# EAGLE schematic MIDICV (EAGLE 7.7.0)
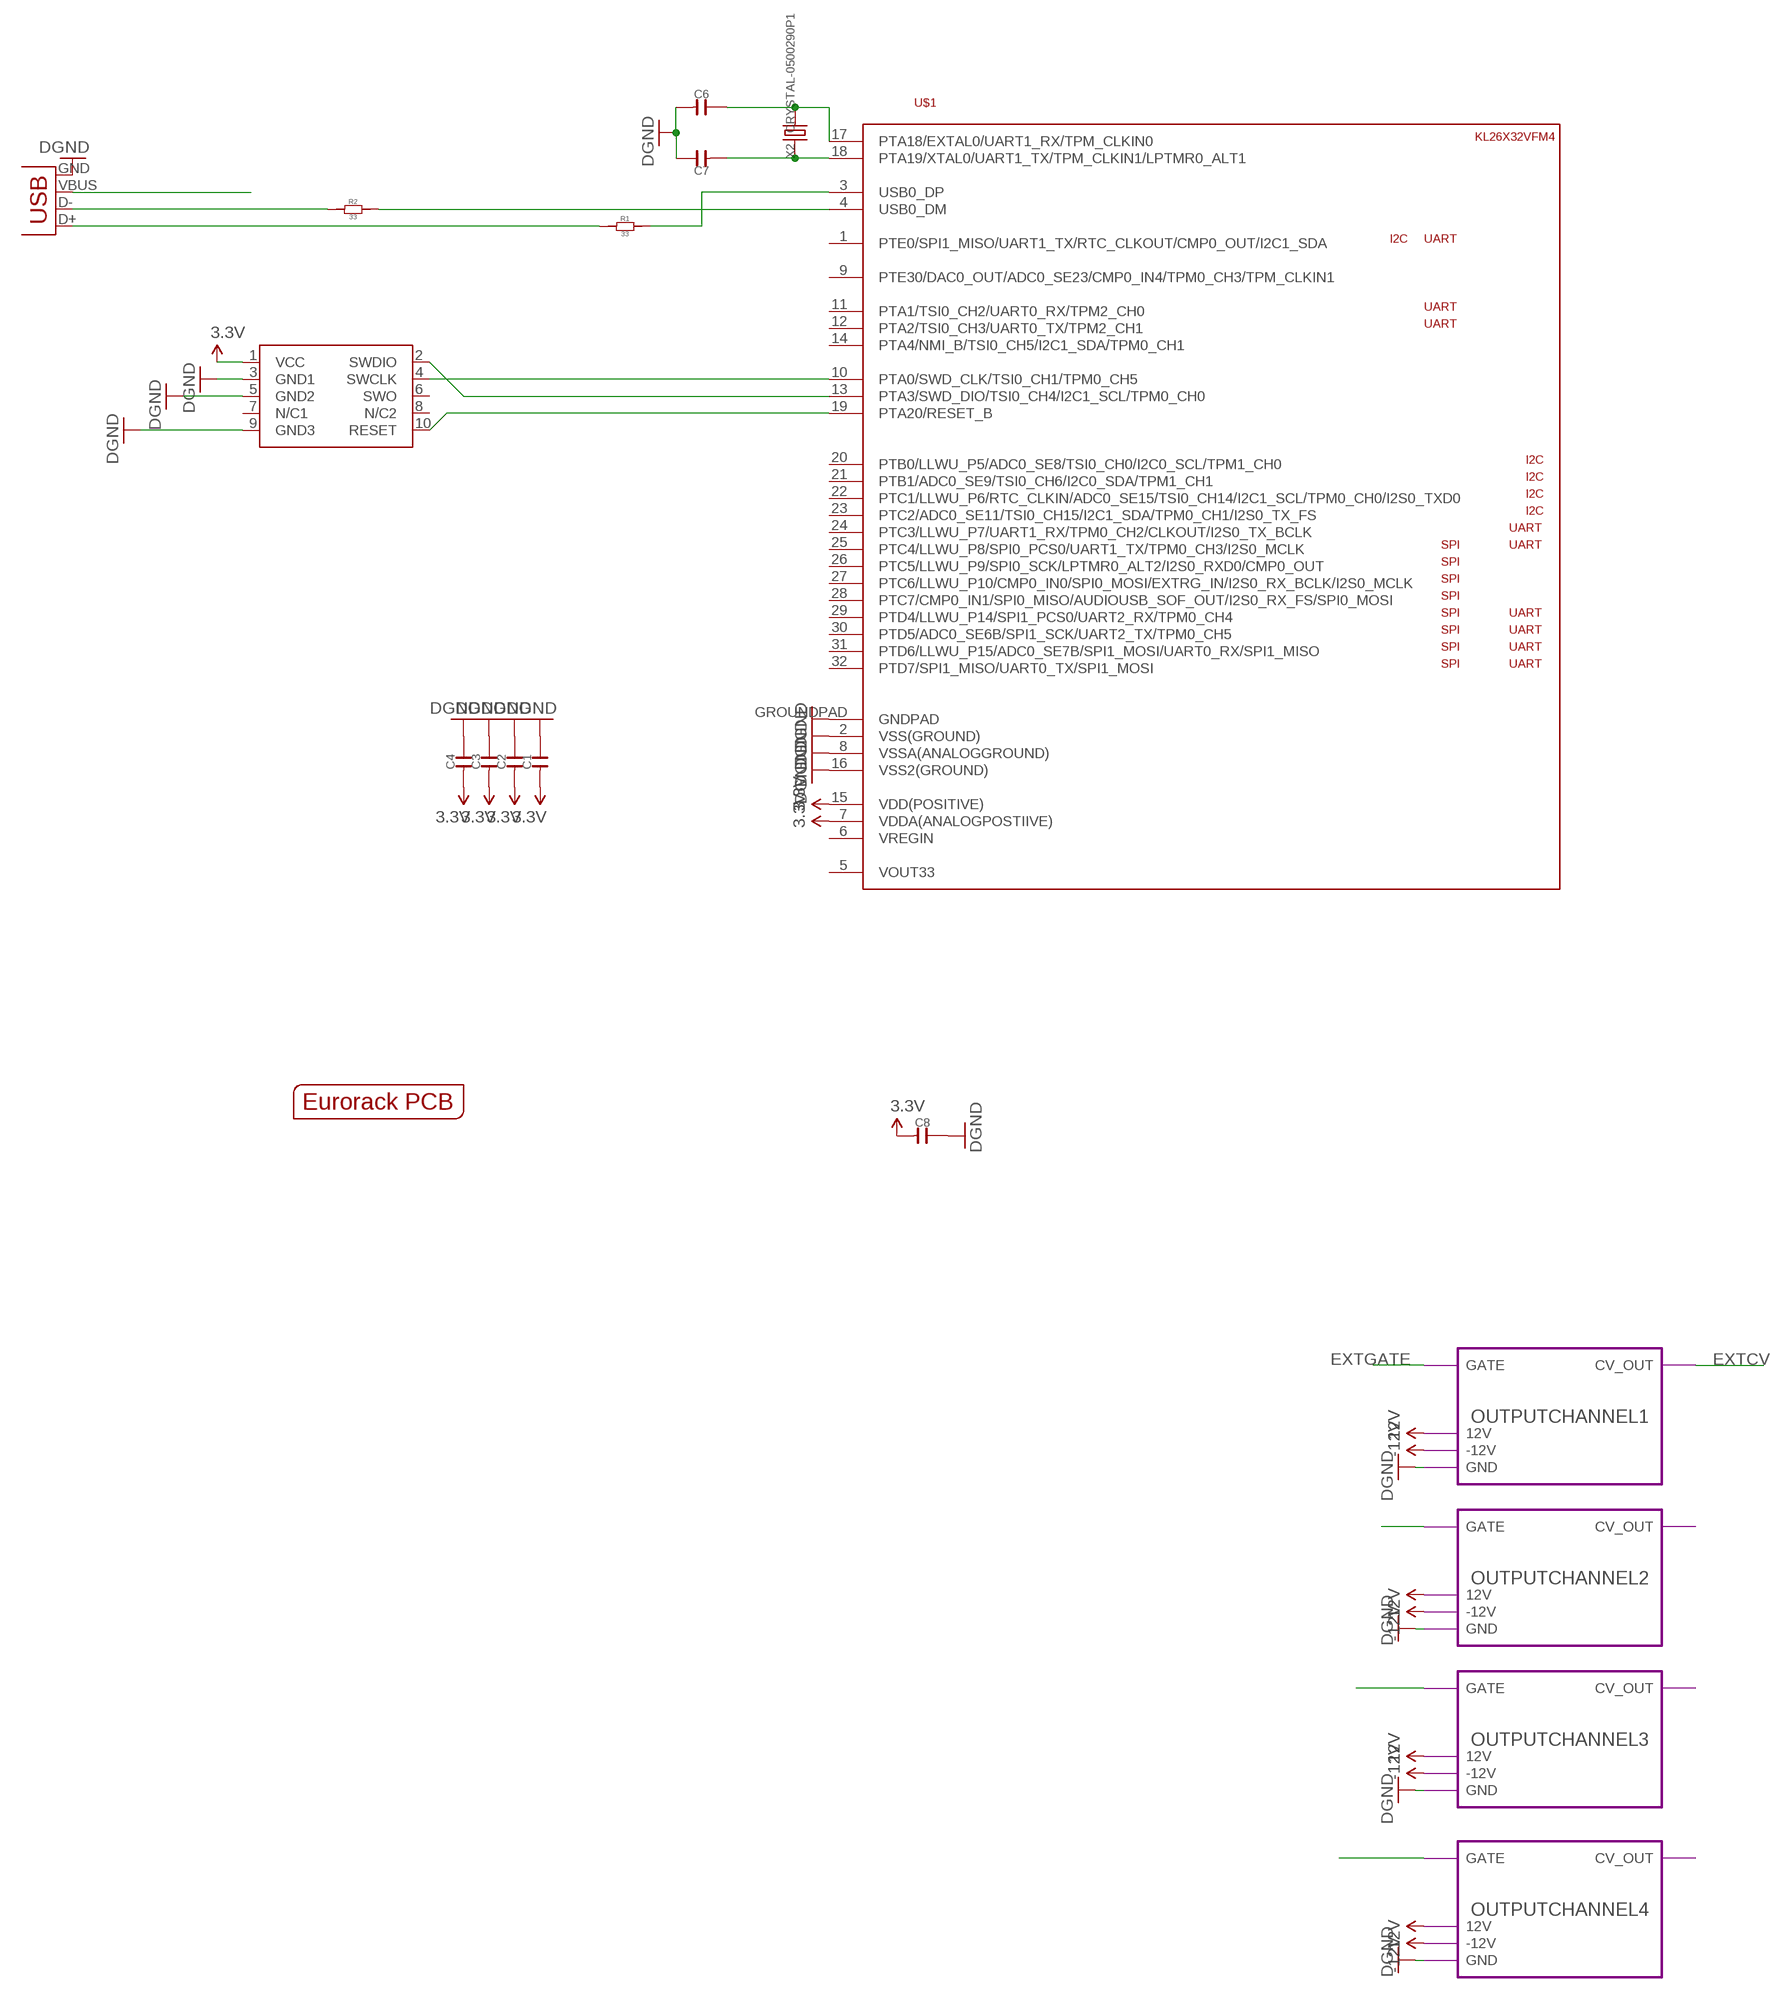
[diagram p0: schematic, sheet 1, part 1 of 2]
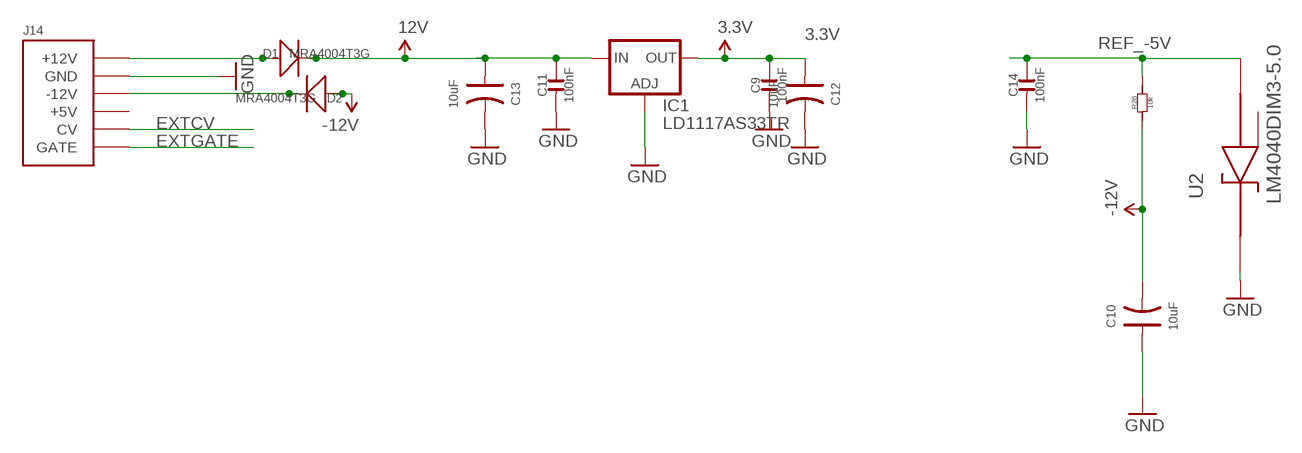
[diagram p1: schematic, sheet 1, part 2 of 2]

## Parts
C1  C-0603  [C0603]
C2  C-0603  [C0603]
C3  C-0603  [C0603]
C4  C-0603  [C0603]
C6  C-0603  [C0603]
C7  C-0603  [C0603]
C8  C-0603  [C0603]
C9  100nF  C-0603  [C0603]
C10  10uF  C-POLAR-A  [AVX-A]
C11  100nF  C-0603  [C0603]
C12  10uF  C-POLAR-A  [AVX-A]
C13  10uF  C-POLAR-A  [AVX-A]
C14  100nF  C-0603  [C0603]
D1  MRA4004T3G  D-SMA  [DO-214AC]
D2  MRA4004T3G  D-SMA  [DO-214AC]
IC1  LD1117AS33TR  [SOT223]
J14  POWERSMT  [2X08_SMT_HEADER]
JP1  USBPTH-VERTICAL  [USB-B-PTH-VERTICAL]
R1  33  R-0603  [R0603]
R2  33  R-0603  [R0603]
R26  10k  R-0603  [R0603]
SWD1  CORTEX_SWD  [M50-3600542]
U2  LM4040DIM3-5.0  [SOT95P237X112-3N]
U$1  KL26X32VFM4  [QFN-32]
U$2  EURORACK_PCB12HP  [EURORACK12HPPCB]
X2  CRYSTAL-0500290P1  [2P-SMD-5.0X3.2]

## Module instances
OUTPUTCHANNEL1 = OUTPUTCHANNEL
OUTPUTCHANNEL2 = OUTPUTCHANNEL
OUTPUTCHANNEL3 = OUTPUTCHANNEL
OUTPUTCHANNEL4 = OUTPUTCHANNEL

## Nets
3.3V: C1.1 C2.1 C3.1 C4.1 C8.1 C9.2 C12.+ IC1.2(OUT) IC1.4(OUT) SWD1.1(VCC) U$1.7(VDDA(ANALOGPOSTIIVE)) U$1.15(VDD(POSITIVE))
12V [heavypower]: C11.2 C13.+ D1.2(-) IC1.3(IN) ; port OUTPUTCHANNEL1.12V OUTPUTCHANNEL2.12V OUTPUTCHANNEL3.12V OUTPUTCHANNEL4.12V
-12V [heavypower]: C10.- D2.1(+) R26.1 ; port OUTPUTCHANNEL2.-12V OUTPUTCHANNEL1.-12V OUTPUTCHANNEL3.-12V OUTPUTCHANNEL4.-12V
BUTTON4: SWD1.10(RESET) U$1.19(PTA20/RESET_B)
EXTCV: J14.13(CV) J14.14(CV) ; port OUTPUTCHANNEL1.CV_OUT
EXTGATE: J14.15(GATE) J14.16(GATE) ; port OUTPUTCHANNEL1.GATE
GND: C1.2 C2.2 C3.2 C4.2 C6.1 C7.2 C8.2 C9.1 C10.+ C11.1 C12.- C13.- C14.1 IC1.1(ADJ) J14.3(GND) J14.4(GND) J14.5(GND) J14.6(GND) J14.7(GND) J14.8(GND) JP1.GND SWD1.3(GND1) SWD1.5(GND2) SWD1.9(GND3) U2.1(CATHODE) U$1.2(VSS(GROUND)) U$1.8(VSSA(ANALOGGROUND)) U$1.16(VSS2(GROUND)) U$1.GROUNDPAD(GNDPAD) ; port OUTPUTCHANNEL1.GND OUTPUTCHANNEL3.GND OUTPUTCHANNEL4.GND OUTPUTCHANNEL2.GND ; supply symbol labelled DGND
N$1: JP1.D- R2.1
N$2: JP1.D+ R1.1
N$3: R1.2 U$1.3(USB0_DP)
N$4: R2.2 U$1.4(USB0_DM)
N$5: port OUTPUTCHANNEL2.GATE
N$6: port OUTPUTCHANNEL3.GATE
N$7: port OUTPUTCHANNEL4.GATE
N$11: C6.2 U$1.17(PTA18/EXTAL0/UART1_RX/TPM_CLKIN0) X2.2
N$12: C7.1 U$1.18(PTA19/XTAL0/UART1_TX/TPM_CLKIN1/LPTMR0_ALT1) X2.1
N$13 [heavypower]: D1.1(+) J14.9(+12V) J14.10(+12V)
N$64 [heavypower]: D2.2(-) J14.1(-12V) J14.2(-12V)
REF_-5V: C14.2 R26.2 U2.2(ANODE)
SWDCLK: SWD1.4(SWCLK) U$1.10(PTA0/SWD_CLK/TSI0_CH1/TPM0_CH5)
SWDIO: SWD1.2(SWDIO) U$1.13(PTA3/SWD_DIO/TSI0_CH4/I2C1_SCL/TPM0_CH0)
VBUS: JP1.VBUS
Unconnected: J14.11(+5V) J14.12(+5V) SWD1.6(SWO) SWD1.7(N/C1) SWD1.8(N/C2) U2.3(NC) U$1.1(PTE0/SPI1_MISO/UART1_TX/RTC_CLKOUT/CMP0_OUT/I2C1_SDA) U$1.5(VOUT33) U$1.6(VREGIN) U$1.9(PTE30/DAC0_OUT/ADC0_SE23/CMP0_IN4/TPM0_CH3/TPM_CLKIN1) U$1.11(PTA1/TSI0_CH2/UART0_RX/TPM2_CH0) U$1.12(PTA2/TSI0_CH3/UART0_TX/TPM2_CH1) U$1.14(PTA4/NMI_B/TSI0_CH5/I2C1_SDA/TPM0_CH1) U$1.20(PTB0/LLWU_P5/ADC0_SE8/TSI0_CH0/I2C0_SCL/TPM1_CH0) U$1.21(PTB1/ADC0_SE9/TSI0_CH6/I2C0_SDA/TPM1_CH1) U$1.22(PTC1/LLWU_P6/RTC_CLKIN/ADC0_SE15/TSI0_CH14/I2C1_SCL/TPM0_CH0/I2S0_TXD0) U$1.23(PTC2/ADC0_SE11/TSI0_CH15/I2C1_SDA/TPM0_CH1/I2S0_TX_FS) U$1.24(PTC3/LLWU_P7/UART1_RX/TPM0_CH2/CLKOUT/I2S0_TX_BCLK) U$1.25(PTC4/LLWU_P8/SPI0_PCS0/UART1_TX/TPM0_CH3/I2S0_MCLK) U$1.26(PTC5/LLWU_P9/SPI0_SCK/LPTMR0_ALT2/I2S0_RXD0/CMP0_OUT) U$1.27(PTC6/LLWU_P10/CMP0_IN0/SPI0_MOSI/EXTRG_IN/I2S0_RX_BCLK/I2S0_MCLK) U$1.28(PTC7/CMP0_IN1/SPI0_MISO/AUDIOUSB_SOF_OUT/I2S0_RX_FS/SPI0_MOSI) U$1.29(PTD4/LLWU_P14/SPI1_PCS0/UART2_RX/TPM0_CH4) U$1.30(PTD5/ADC0_SE6B/SPI1_SCK/UART2_TX/TPM0_CH5) U$1.31(PTD6/LLWU_P15/ADC0_SE7B/SPI1_MOSI/UART0_RX/SPI1_MISO) U$1.32(PTD7/SPI1_MISO/UART0_TX/SPI1_MOSI)

## Library data of the parts
C1-C4 C6-C8 = OPL:C*
C9 C11 = OPL:C*; MF: MULTICOMP; MPN: MC0603F104Z160CT; OC_FARNELL: 1759017
C10 C12 C13 = OPL:C-POLAR*; MF: AVX; MPN: TAJB106K020RNJ; OC_FARNELL: 197427
C14 = OPL:C*; MF: AVX; MPN: 06035C104KAT2A; OC_FARNELL: 1301804
D1 D2 = OPL:D*: DIODE; MF: VISHAY; MPN: US1G-E3/5AT; OC_FARNELL: 9551824
IC1 = ld-components:LD1117A?*: Low drop fixed and adjustable positive voltage regulators 1 A Source: http://www.st.com/stonline/products/literature/ds/7194/ld1117axx.pdf; MF: STMICROELECTRONICS; MPN: LD1117AS33TR; OC_FARNELL: 1467776
J14 = EurorackModularParts:POWER; OC_FARNELL: unknown
JP1 = SparkFun-Connectors:USB: USB Connectors USB-B-PTH is fully proven SKU : PRT-00139/CONN-08278 USB-miniB is fully proven SKU : PRT-00587 USB-A-PCB is untested. USB-A-H is throughly reviewed, but untested. Spark Fun Electronics SKU : PRT-00437 USB-B-SMT is throughly reviewed, but untested. Needs silkscreen touching up. USB-A-S has not been used/tested USB-MB-H has not been used/tested USB-MICROB has been used. CONN-09505
R1 R2 = OPL:R*
R26 = OPL:R*; OC_FARNELL: unknown
SWD1 = carrilib with jtags:CORTEX_SWD: .05" Cortex M Connector in SWD mode Manufacturer: Generic Part Number: Cortex M SWD Notes: I use Harwin M50-3600542 connectors
U2 = FarnellThings:LM4040DIM3-5.0: IC, Precision Micropower Shunt Voltage Reference, 5V,SOT-23-3; MF: TEXAS INSTRUMENTS; MPN: LM4040DIM3-5.0; OC_FARNELL: 9778330; OC_NEWARK: 97K3489; PACKAGE: SOT-23-3; SUPPLIER: TEXAS INSTRUMENTS
U$1 = MK26-QFN:KL26X32VFM4
U$2 = EurorackModularParts:EURORACK_PCB
X2 = OPL:CRYSTAL*

## Module OUTPUTCHANNEL
Ports: GND(io) -12V(io) 12V(io) GATE(io) CV_OUT(io)
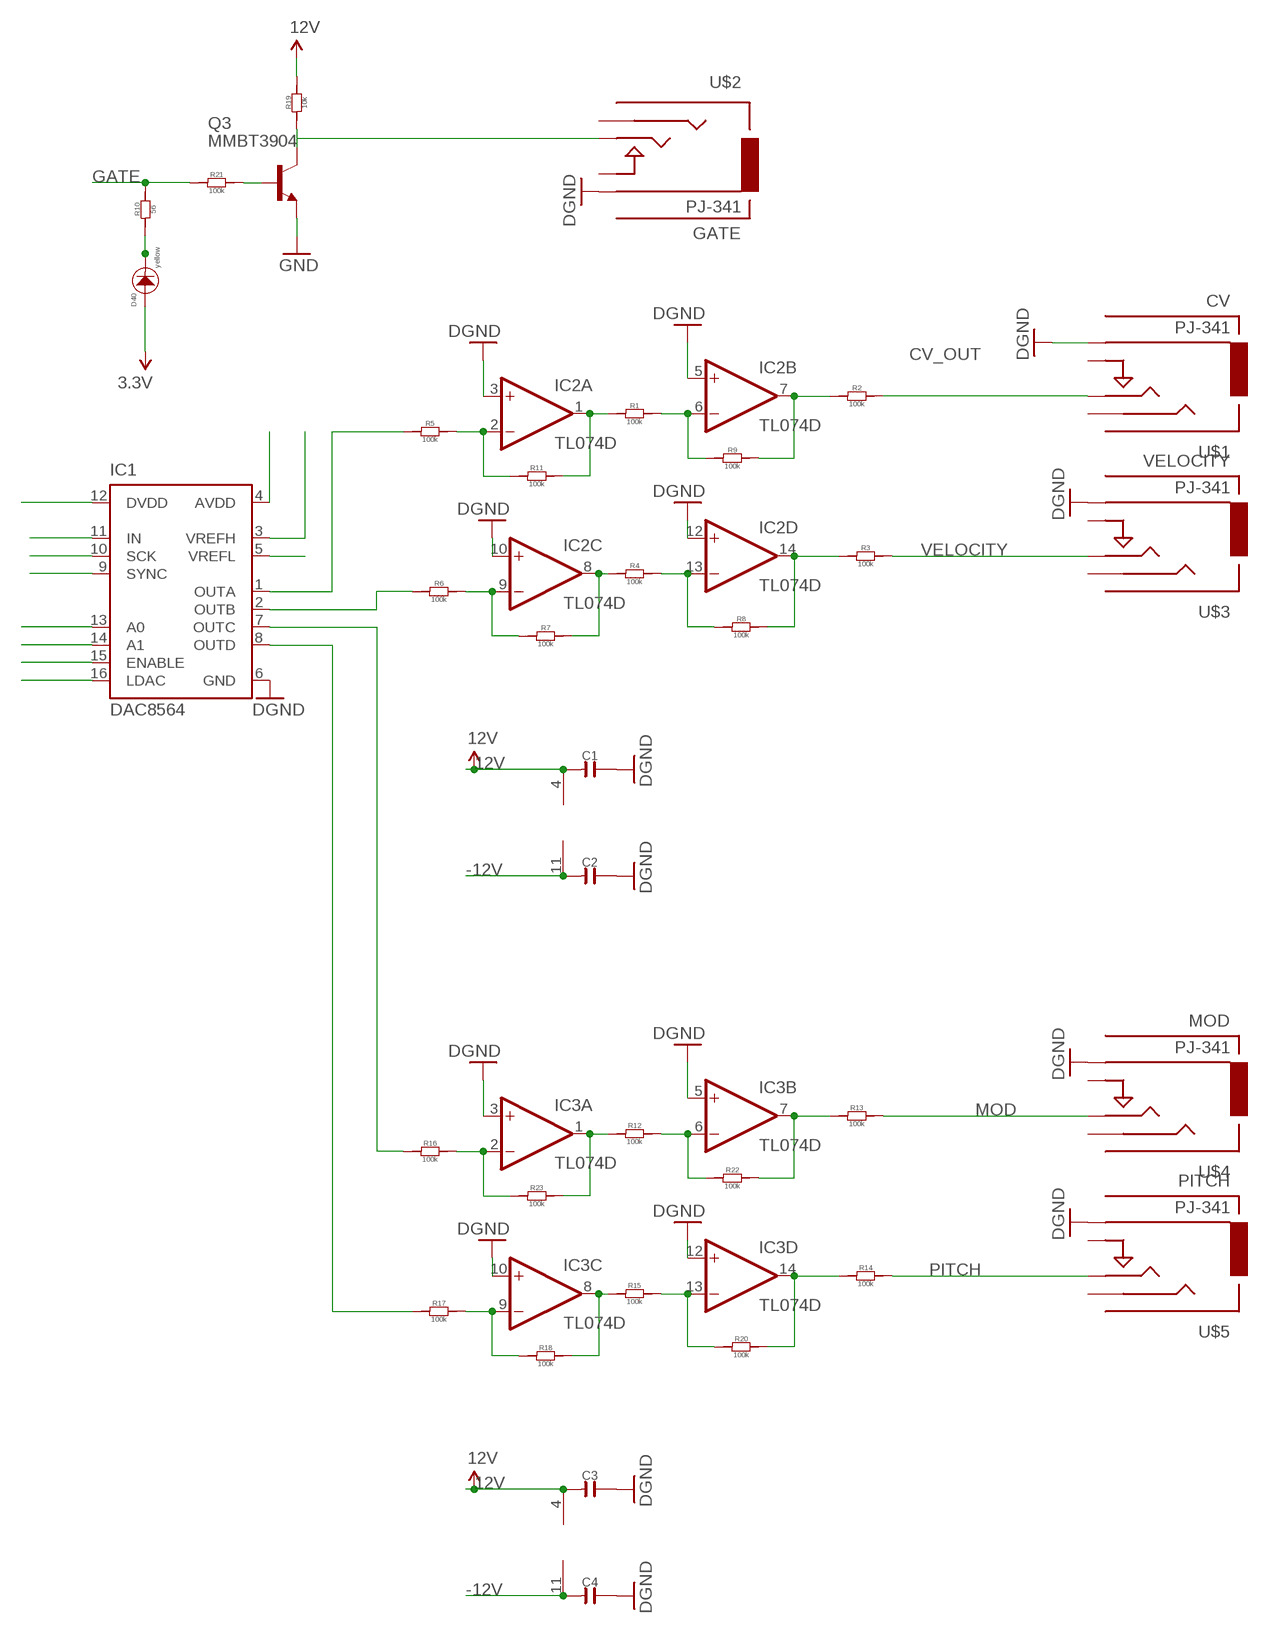
[diagram p2: schematic, module OUTPUTCHANNEL, sheet 1]

### Parts
C1  C-0603  [C0603]
C2  C-0603  [C0603]
C3  C-0603  [C0603]
C4  C-0603  [C0603]
D40  yellow  LED3MM  [3MMLED]
IC1  DAC8564  [SOP65P640X110-16N]
IC2  TL074D  [SO14]
IC3  TL074D  [SO14]
Q3  MMBT3904  MMBT3904LT1-NPN-SOT23-BEC  [SOT23-BEC]
R1  100k  R-0603  [R0603]
R2  100k  R-0603  [R0603]
R3  100k  R-0603  [R0603]
R4  100k  R-0603  [R0603]
R5  100k  R-0603  [R0603]
R6  100k  R-0603  [R0603]
R7  100k  R-0603  [R0603]
R8  100k  R-0603  [R0603]
R9  100k  R-0603  [R0603]
R10  56  R-0603  [R0603]
R11  100k  R-0603  [R0603]
R12  100k  R-0603  [R0603]
R13  100k  R-0603  [R0603]
R14  100k  R-0603  [R0603]
R15  100k  R-0603  [R0603]
R16  100k  R-0603  [R0603]
R17  100k  R-0603  [R0603]
R18  100k  R-0603  [R0603]
R19  10k  R-0603  [R0603]
R20  100k  R-0603  [R0603]
R21  100k  R-0603  [R0603]
R22  100k  R-0603  [R0603]
R23  100k  R-0603  [R0603]
U$1  PJ-341  AUDIO-JACKOUTPUT  [3.5MM-JACK-SWITCH-13MM-OUTPUT]
U$2  PJ-341  AUDIO-JACKOUTPUT  [3.5MM-JACK-SWITCH-13MM-OUTPUT]
U$3  PJ-341  AUDIO-JACKOUTPUT  [3.5MM-JACK-SWITCH-13MM-OUTPUT]
U$4  PJ-341  AUDIO-JACKOUTPUT  [3.5MM-JACK-SWITCH-13MM-OUTPUT]
U$5  PJ-341  AUDIO-JACKOUTPUT  [3.5MM-JACK-SWITCH-13MM-OUTPUT]

### Nets
3.3V [mediumpower]: D40.+
12V: C1.1 C3.1 IC2.4(P:V+) IC3.4(P:V+) R19.2
-12V: C2.1 C4.1 IC2.11(P:V-) IC3.11(P:V-)
CV_OUT: R2.2 U$1.TIP@3(TIP)
GATE: R10.2 R21.1
GND: C1.2 C2.2 C3.2 C4.2 IC1.6(GND) IC2.3(A:+IN) IC2.5(B:+IN) IC2.10(C:+IN) IC2.12(D:+IN) IC3.3(A:+IN) IC3.5(B:+IN) IC3.10(C:+IN) IC3.12(D:+IN) Q3.E U$1.RING@3(RING) U$2.RING@3(RING) U$3.RING@3(RING) U$4.RING@3(RING) U$5.RING@3(RING) ; supply symbol labelled DGND
MOD: R13.2 U$4.TIP@3(TIP)
N$1: IC1.15(ENABLE)
N$2: IC1.11(IN)
N$3: IC1.10(SCK)
N$4: IC1.9(SYNC)
N$5: IC2.6(B:-IN) R1.2 R9.1
N$6: IC2.13(D:-IN) R4.2 R8.1
N$8: IC2.14(D:OUT) R3.1 R8.2
N$9: IC2.7(B:OUT) R2.1 R9.2
N$11: IC2.1(A:OUT) R1.1 R11.2
N$12: IC2.8(C:OUT) R4.1 R7.2
N$13: IC2.2(A:-IN) R5.2 R11.1
N$14: IC2.9(C:-IN) R6.2 R7.1
N$15: IC1.2(OUTB) R6.1
N$16: IC1.1(OUTA) R5.1
N$17: IC3.6(B:-IN) R12.2 R22.1
N$18: IC3.13(D:-IN) R15.2 R20.1
N$20: IC3.14(D:OUT) R14.1 R20.2
N$21: IC3.7(B:OUT) R13.1 R22.2
N$23: D40.- R10.1
N$24: IC3.1(A:OUT) R12.1 R23.2
N$25: Q3.B R21.2
N$26: IC3.8(C:OUT) R15.1 R18.2
N$27: IC3.2(A:-IN) R16.2 R23.1
N$28: IC3.9(C:-IN) R17.2 R18.1
N$29: Q3.C R19.1 U$2.TIP@3(TIP)
N$30: IC1.8(OUTD) R17.1
N$31: IC1.7(OUTC) R16.1
N$35: IC1.13(A0)
N$36: IC1.14(A1)
N$37: IC1.16(LDAC)
N$38: IC1.12(DVDD)
N$39: IC1.3(VREFH)
N$40: IC1.5(VREFL)
N$41: IC1.4(AVDD)
PITCH: R14.2 U$5.TIP@3(TIP)
VELOCITY: R3.2 U$3.TIP@3(TIP)
Unconnected: U$1.SECOND@3(SECOND) U$1.SWITCH@3(SWITCH) U$2.SECOND@3(SECOND) U$2.SWITCH@3(SWITCH) U$3.SECOND@3(SECOND) U$3.SWITCH@3(SWITCH) U$4.SECOND@3(SECOND) U$4.SWITCH@3(SWITCH) U$5.SECOND@3(SECOND) U$5.SWITCH@3(SWITCH)

### Library data of the parts
C1-C4 = OPL:C*
D40 = EurorackModularParts:LED*: LED
IC1 = EurorackModularParts:DAC8564
IC2 IC3 = EurorackModularParts:TL074: OP AMP
Q3 = transistor:*-NPN-: NPN Transistror BF959 corrected 2008.03.06; MF: NXP; MPN: PMBT3904,215; OC_FARNELL: 2336795
R1-R23 = OPL:R*; OC_FARNELL: unknown
U$1 = EurorackModularParts:AUDIO-JACK: Switching Mono 3.5mm Audio Jack from Erthenvar.; DESC: CV; MPN: PJ-341
U$2 = EurorackModularParts:AUDIO-JACK: Switching Mono 3.5mm Audio Jack from Erthenvar.; DESC: GATE; MPN: PJ-341
U$3 = EurorackModularParts:AUDIO-JACK: Switching Mono 3.5mm Audio Jack from Erthenvar.; DESC: VELOCITY; MPN: PJ-341
U$4 = EurorackModularParts:AUDIO-JACK: Switching Mono 3.5mm Audio Jack from Erthenvar.; DESC: MOD; MPN: PJ-341
U$5 = EurorackModularParts:AUDIO-JACK: Switching Mono 3.5mm Audio Jack from Erthenvar.; DESC: PITCH; MPN: PJ-341

## Net classes
0 default: width 0.203 mm, clearance 0.178 mm
1 heavypower: width 0.381 mm
2 mediumpower: width 0.254 mm
3 groundplane: width 0.178 mm, clearance 0.178 mm